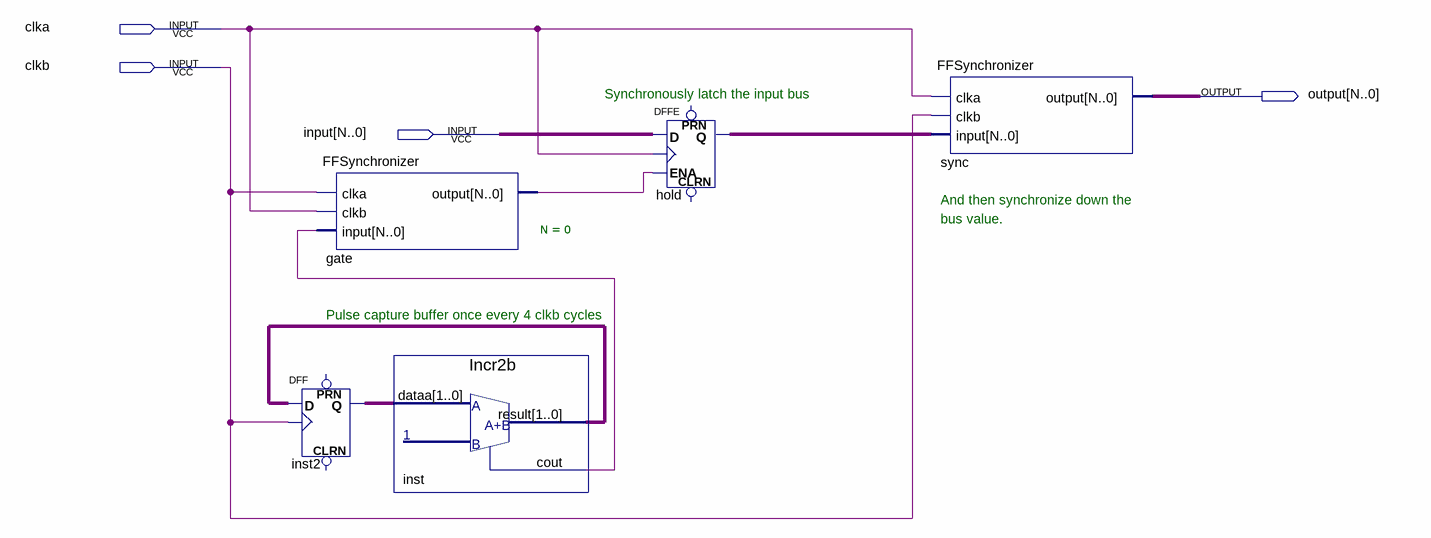
[diagram p0: schematic sheet]
// Quartus schematic SamplingSynchronizer.bdf as structural Verilog: 5 symbols, 4 pins
module SamplingSynchronizer (
  input  clka,
  input  clkb,
  input  \input[N..0] ,
  output \output[N..0] 
);

  wire gate_output, hold_q, inst_cout;
  wire [1:0] inst2_q, inst_result;

  DFF inst2[1:0] (.CLK(clkb), .D(inst_result), .Q(inst2_q));  // open: CLRN, PRN
  FFSynchronizer #(.N(0)) gate (.clka(clkb), .clkb(clka), .\input (inst_cout), .\output (gate_output));
  Incr2b inst (.dataa(inst2_q), .result(inst_result), .cout(inst_cout));
  DFFE hold (.D(\input[N..0] ), .CLK(clka), .ENA(gate_output), .Q(hold_q));  // open: PRN, CLRN
  FFSynchronizer sync (.clka(clka), .clkb(clkb), .\input (hold_q), .\output (\output[N..0] ));

  // Notes on the sheet:
  //   Synchronously latch the input bus
  //   And then synchronize down the
  //   bus value.
  //   Pulse capture buffer once every 4 clkb cycles
endmodule
